# EAGLE design morse_lora_v1 (EAGLE 9.6.2)
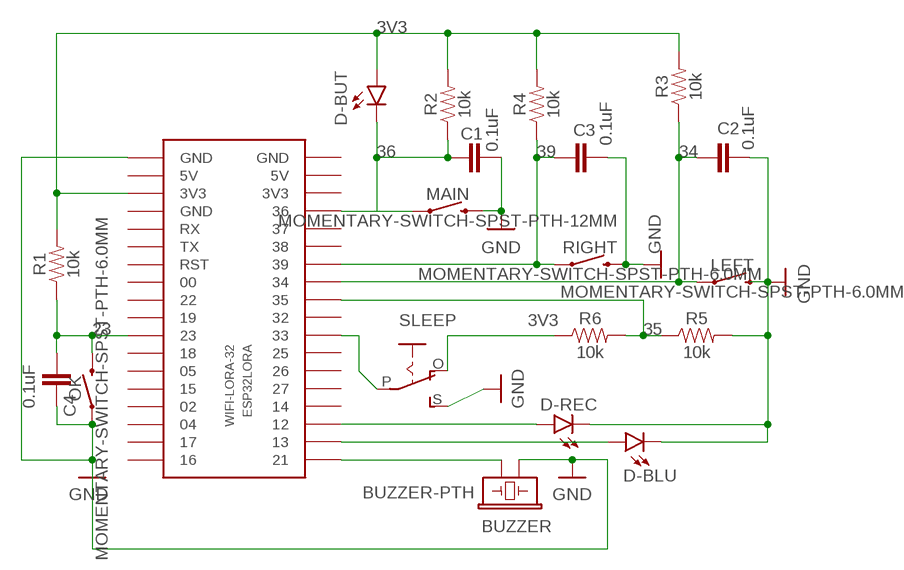
[diagram p0: schematic, sheet 1]

## Parts
BUZZER  BUZZER-PTH  [BUZZER-12MM]
C1  0.1uF  0.1UF-KIT-EZ-50V-20%  [CAP-PTH-SMALL-KIT]
C2  0.1uF  0.1UF-KIT-EZ-50V-20%  [CAP-PTH-SMALL-KIT]
C3  0.1uF  0.1UF-KIT-EZ-50V-20%  [CAP-PTH-SMALL-KIT]
C4  0.1uF  0.1UF-KIT-EZ-50V-20%  [CAP-PTH-SMALL-KIT]
D-BLU  LED5MM  [LED_5MM]
D-BUT  LED5MM  [LED_5MM]
D-REC  LED5MM  [LED_5MM]
ESP32LORA  WIFI-LORA-32  [2.54MM_2X18]
LEFT  MOMENTARY-SWITCH-SPST-PTH-6.0MM  [TACTILE_SWITCH_PTH_6.0MM]
MAIN  MOMENTARY-SWITCH-SPST-PTH-12MM  [TACTILE_SWITCH_PTH_12MM]
OK  MOMENTARY-SWITCH-SPST-PTH-6.0MM  [TACTILE_SWITCH_PTH_6.0MM]
R1  10k  10KOHM-HORIZ_KIT-1/4W-1%  [AXIAL-0.3-KIT]
R2  10k  10KOHM-HORIZ_KIT-1/4W-1%  [AXIAL-0.3-KIT]
R3  10k  10KOHM-HORIZ_KIT-1/4W-1%  [AXIAL-0.3-KIT]
R4  10k  10KOHM-HORIZ_KIT-1/4W-1%  [AXIAL-0.3-KIT]
R5  10k  10KOHM-HORIZ_KIT-1/4W-1%  [AXIAL-0.3-KIT]
R6  10k  10KOHM-HORIZ_KIT-1/4W-1%  [AXIAL-0.3-KIT]
RIGHT  MOMENTARY-SWITCH-SPST-PTH-6.0MM  [TACTILE_SWITCH_PTH_6.0MM]
SLEEP  EG1218S  [EG1218]

## Nets
3V3: D-BUT.A ESP32LORA.P$3(3V3) R1.P$2 R2.P$2 R3.P$2 R4.P$2 R6.P$1 SLEEP.O
23: C4.2 ESP32LORA.P$11 OK.3 R1.P$1
34: C2.2 ESP32LORA.P$29 LEFT.1 R3.P$1
35: ESP32LORA.P$28 R5.P$1 R6.P$2
36: C1.2 D-BUT.K(C) ESP32LORA.P$33 MAIN.1 R2.P$1
39: C3.1 ESP32LORA.P$30 R4.P$1 RIGHT.1
GND: BUZZER.- C1.1 C2.1 C3.2 C4.1 D-BLU.K(C) D-REC.K(C) ESP32LORA.P$1(GND) LEFT.3 MAIN.3 OK.1 R5.P$2 RIGHT.3 SLEEP.S
N$4: BUZZER.+ ESP32LORA.P$19
N$5: D-REC.A ESP32LORA.P$21
N$6: D-BLU.A ESP32LORA.P$20
N$13: ESP32LORA.P$26 SLEEP.P
Unconnected: ESP32LORA.P$2(5V) ESP32LORA.P$4(GND) ESP32LORA.P$5(RX) ESP32LORA.P$6(TX) ESP32LORA.P$7(RST) ESP32LORA.P$8 ESP32LORA.P$9 ESP32LORA.P$10 ESP32LORA.P$12 ESP32LORA.P$13 ESP32LORA.P$14 ESP32LORA.P$15 ESP32LORA.P$16 ESP32LORA.P$17 ESP32LORA.P$18 ESP32LORA.P$22 ESP32LORA.P$23 ESP32LORA.P$24 ESP32LORA.P$25 ESP32LORA.P$27 ESP32LORA.P$31 ESP32LORA.P$32 ESP32LORA.P$34(3V3) ESP32LORA.P$35(5V) ESP32LORA.P$36(GND)

## Library data of the parts
BUZZER = SparkFun-Electromechanical:BUZZER: Buzzer Small round buzzers that operate around the audible 2kHz range. You can use these as speakers to create simple music or user interfaces. Variant Overview: PTH - Mini Speaker - PC Mount 12mm 2.048kHz <https://www.sparkfun.com/products/7950> PTH_KIT - Mini Speaker - PC Mount 12mm 2.048kHz <https://www.sparkfun.com/products/7950> KIT simplifies soldering by adding stop mask to one side of the pads. PTH_NO_SILK - Mini Speaker - PC Mount 12mm 2.048kHz <https://www.sparkfun.com/products/7950> No silkscreen indicator of buzzer outline. PTH_KIT_NO_SILK - Mini Speaker - PC Mount 12mm 2.048kHz <https://www.sparkfun.com/products/7950> KIT package w/o silkscreen SMD - Buzzer Audio Magnetic (CCV-084B16) SMD buzzer used on, e.g. the LilyPad Buzzer <https://www.sparkfun.com/products/8463> and RFID USB Reader <https://www.sparkfun.com/products/9963>. SMD_KIT - Buzzer Audio Magnetic (CCV-084B16) SMD Buzzer with elongated pins to make soldering easier. Used on the SparkFun Simon Says - Surface Mount Soldering Kit <https://www.sparkfun.com/products/10935>.; PROD_ID: COMP-08253; SF_SKU: COM-07950
C1-C4 = SparkFun-Capacitors:0.1UF: 0.1µF ceramic capacitors A capacitor is a passive two-terminal electrical component used to store electrical energy temporarily in an electric field.; PROD_ID: CAP-08370
D-BLU D-BUT D-REC = SparkFun-LED:LED: LED (Generic) Standard schematic elements and footprints for 5mm, 3mm, 1206, and 0603 sized LEDs. Generic LEDs with no color specified.
ESP32LORA = ESP32_modules:WIFI-LORA-32
LEFT OK RIGHT = SparkFun-Switches:MOMENTARY-SWITCH-SPST: Momentary Switch (Pushbutton) - SPST Normally-open (NO) SPST momentary switches (buttons, pushbuttons). Variants PTH-12MM - 12mm square, through-hole Momentary Pushbutton Switch - 12mm Square <https://www.sparkfun.com/products/9190> (COM-09190) PTH-6.0MM, PTH-6.0MM-KIT - 6.0mm square, through-hole Mini Pushbutton Switch <https://www.sparkfun.com/products/97> (COM-00097) KIT package intended for soldering kit's - only one side of pads' copper is exposed. PTH-RIGHT-ANGLE-KIT - Right-angle, through-hole Right Angle Tactile Button <https://www.sparkfun.com/products/10791> - Used on SparkFun BigTime Watch Kit <https://www.sparkfun.com/products/11734> SMD-12MM - 12mm square, surface-mount Tactile Button - SMD (12mm) <https://www.sparkfun.com/products/12993> (COM-12993) Used on SparkFun PicoBoard <https://www.sparkfun.com/products/11888> SMD-4.5MM - 4.5mm Square Trackball Switch Used on SparkFun Blackberry Trackballer Breakout <https://www.sparkfun.com/products/13169> SMD-4.6MMX2.8MM - 4.60mm x 2.80mm, surface mount Used on SparkFun SAMD21 Mini Breakout <https://www.sparkfun.com/products/13664> SMD-5.2MM, SMD-5.2-REDUNDANT - 5.2mm square, surface-mount Mini Pushbutton Switch - SMD <https://www.sparkfun.com/products/8720> (COM-08720) Used on Arduino Pro Mini <https://www.sparkfun.com/products/11114> REDUNDANT package connects both switch circuits together SMD-6.0X3.5MM - 6.0 x 3.5mm, surface mount Momentary Reset Switch SMD <https://www.sparkfun.com/products/8229> (COM-08229) SMD-6.2MM-TALL - 6.2mm square, surface mount Tactile Button - SMD (6mm) <https://www.sparkfun.com/products/12992> Used on SparkFun Digital Sandbox <https://www.sparkfun.com/products/12651> SMD-RIGHT-ANGLE - Right-angle, surface mount Used on SparkFun Block for Intel® Edison - Arduino <https://www.sparkfun.com/products/13036>; PROD_ID: SWCH-08441; SF_SKU: COM-00097
MAIN = SparkFun-Switches:MOMENTARY-SWITCH-SPST: Momentary Switch (Pushbutton) - SPST Normally-open (NO) SPST momentary switches (buttons, pushbuttons). Variants PTH-12MM - 12mm square, through-hole Momentary Pushbutton Switch - 12mm Square <https://www.sparkfun.com/products/9190> (COM-09190) PTH-6.0MM, PTH-6.0MM-KIT - 6.0mm square, through-hole Mini Pushbutton Switch <https://www.sparkfun.com/products/97> (COM-00097) KIT package intended for soldering kit's - only one side of pads' copper is exposed. PTH-RIGHT-ANGLE-KIT - Right-angle, through-hole Right Angle Tactile Button <https://www.sparkfun.com/products/10791> - Used on SparkFun BigTime Watch Kit <https://www.sparkfun.com/products/11734> SMD-12MM - 12mm square, surface-mount Tactile Button - SMD (12mm) <https://www.sparkfun.com/products/12993> (COM-12993) Used on SparkFun PicoBoard <https://www.sparkfun.com/products/11888> SMD-4.5MM - 4.5mm Square Trackball Switch Used on SparkFun Blackberry Trackballer Breakout <https://www.sparkfun.com/products/13169> SMD-4.6MMX2.8MM - 4.60mm x 2.80mm, surface mount Used on SparkFun SAMD21 Mini Breakout <https://www.sparkfun.com/products/13664> SMD-5.2MM, SMD-5.2-REDUNDANT - 5.2mm square, surface-mount Mini Pushbutton Switch - SMD <https://www.sparkfun.com/products/8720> (COM-08720) Used on Arduino Pro Mini <https://www.sparkfun.com/products/11114> REDUNDANT package connects both switch circuits together SMD-6.0X3.5MM - 6.0 x 3.5mm, surface mount Momentary Reset Switch SMD <https://www.sparkfun.com/products/8229> (COM-08229) SMD-6.2MM-TALL - 6.2mm square, surface mount Tactile Button - SMD (6mm) <https://www.sparkfun.com/products/12992> Used on SparkFun Digital Sandbox <https://www.sparkfun.com/products/12651> SMD-RIGHT-ANGLE - Right-angle, surface mount Used on SparkFun Block for Intel® Edison - Arduino <https://www.sparkfun.com/products/13036>; PROD_ID: SWCH-09185; SF_SKU: COM-09190
R1-R6 = SparkFun-Resistors:10KOHM: 10kΩ resistor A resistor is a passive two-terminal electrical component that implements electrical resistance as a circuit element. Resistors act to reduce current flow, and, at the same time, act to lower voltage levels within circuits. - Wikipedia; PROD_ID: RES-12183
SLEEP = adafruit:EG1218: SLIDING SWITCH 0.1" spacing through hole, vertical SPDT slide switch http://www.ladyada.net/library/pcb/eaglelibrary.html

## Board
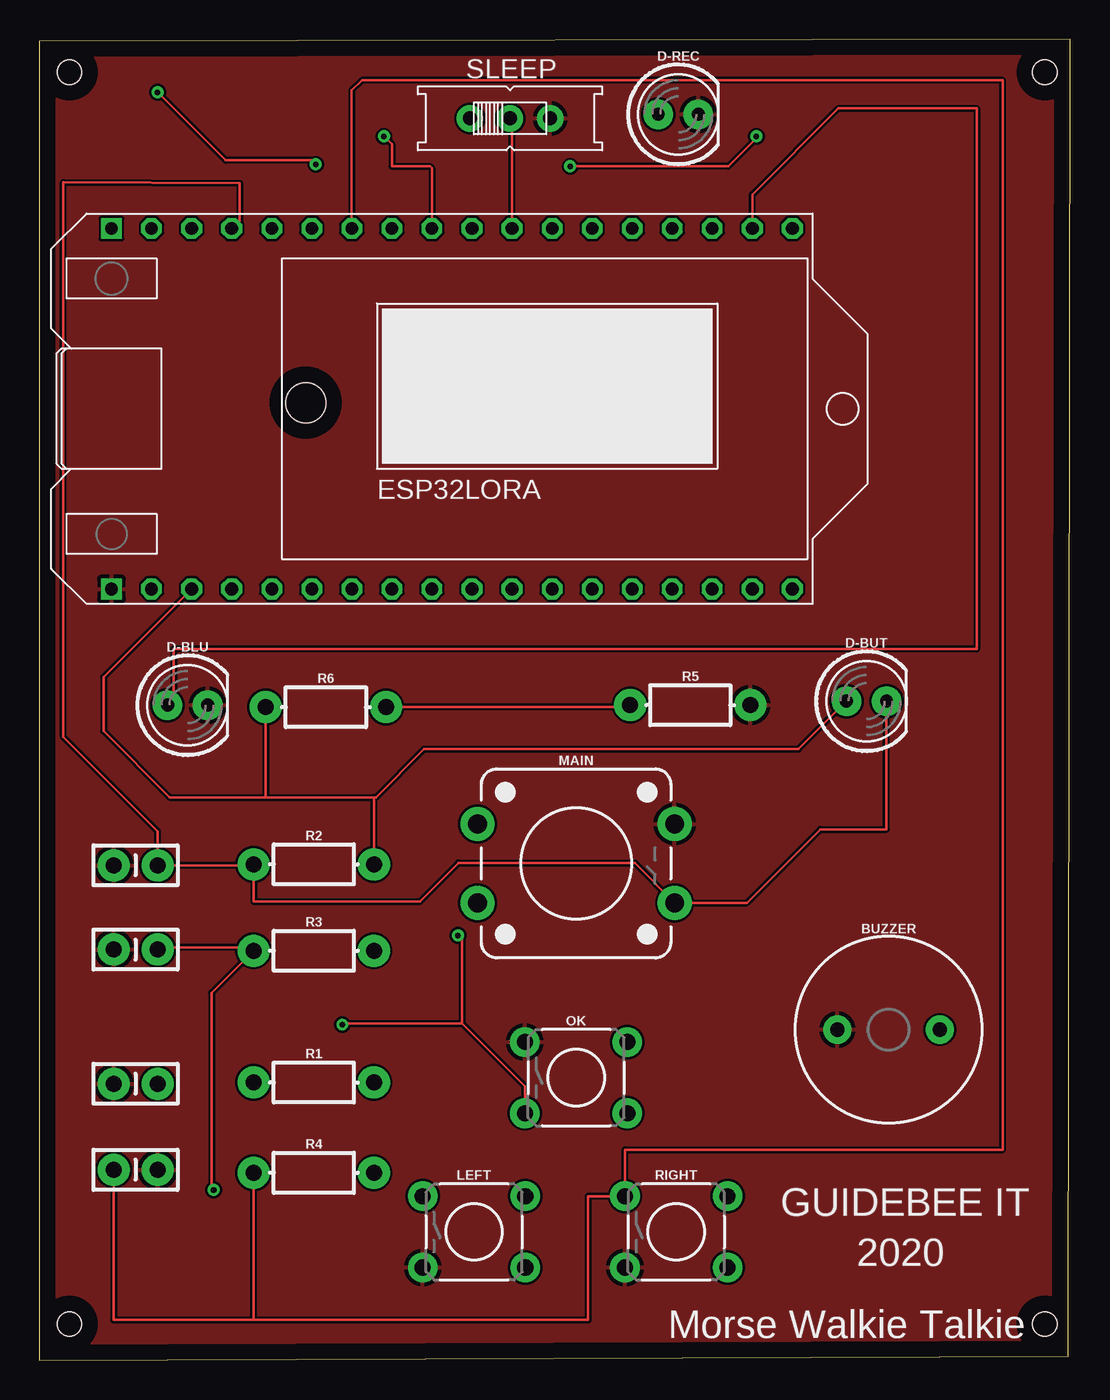
[diagram p1: board, top side]
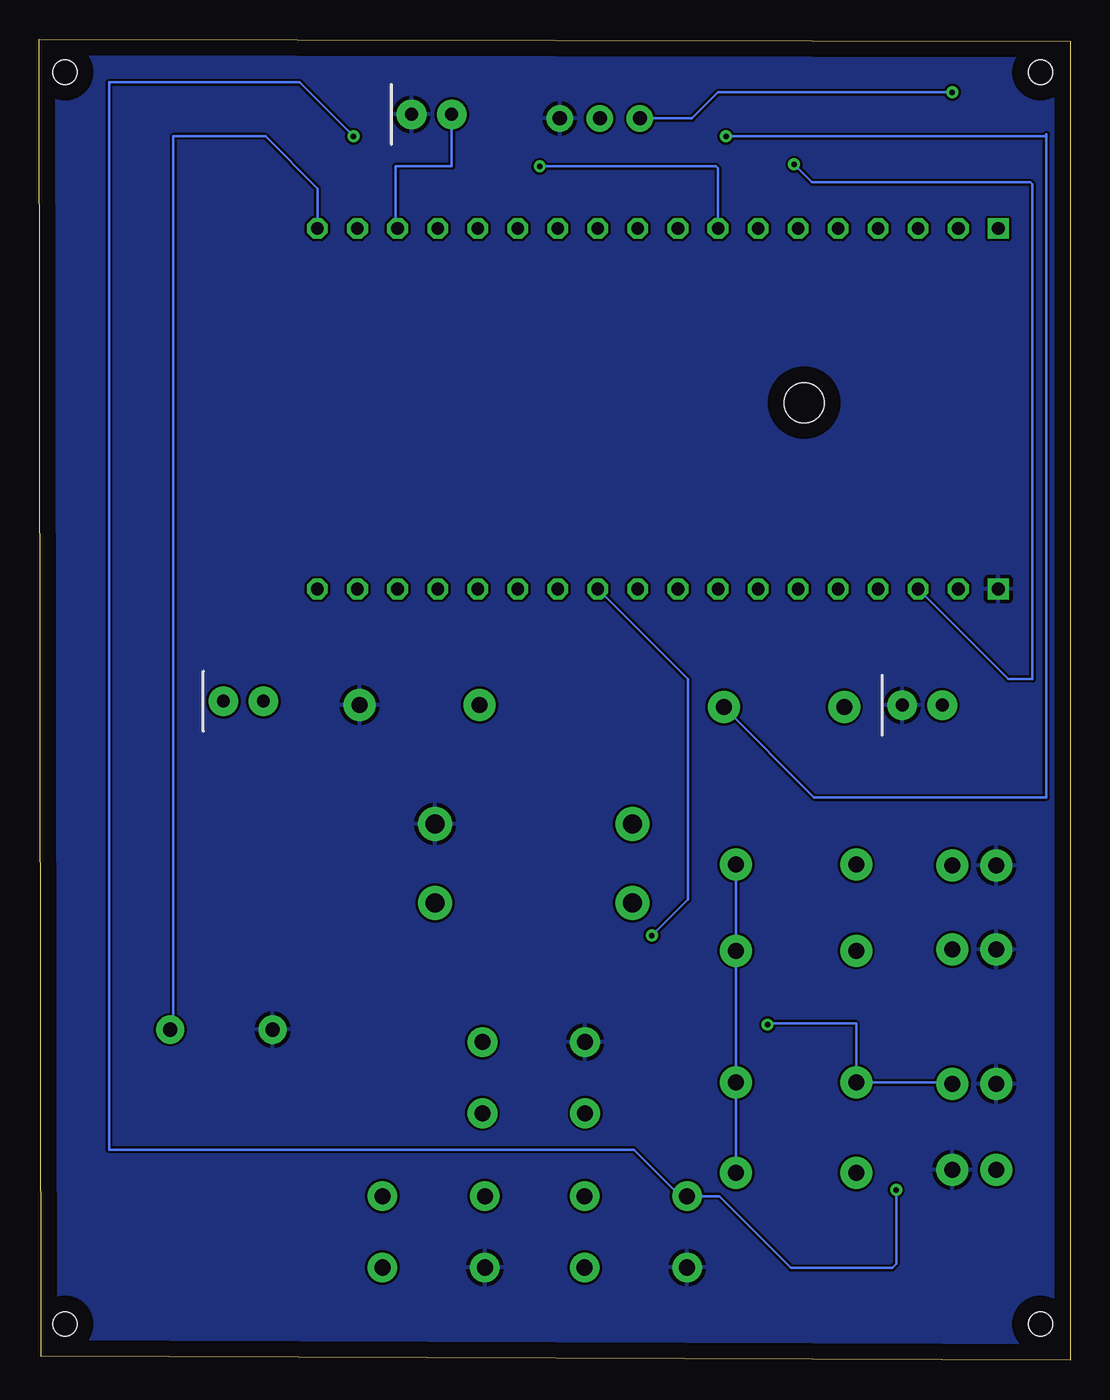
[diagram p2: board, bottom side, seen from below]

Size 65.38 x 83.74 mm. Coordinates in mm from the lower left corner, seen from the top.
Outline: 0,0 65.26,0.25 65.38,83.74 0,83.62 0,0
Copper layers (1*16): Top 0.035mm / dielectric 1.5mm / Bottom 0.035mm
Design rules "default": minimum track width 6mil, minimum drill 0.35mm, track to track 6mil, track to pad 6mil, pad to pad 6mil, via to via 6mil, smd to smd 6mil, copper to edge 40mil, drill to drill 6mil, minimum pad ring 10mil, minimum via ring 8mil, stop-mask expansion 4mil, vias tented up to drill 0mil, thermal gap 10mil
Holes 1.52 mm at 1.91,81.66 63.75,81.66 63.75,2.29 1.91,2.29
Holes 2.54 mm at 16.89,60.71

### Footprints (pad centres in the part's own frame; a part is rotated, then mirrored left to right if it is on the bottom)
BUZZER-12MM = drill 0.9 pad 1.778: + 3.25,0; - -3.25,0
CAP-PTH-SMALL-KIT = drill 1.016 pad 2.032: 1 -1.397,0; 2 1.397,0
LED_5MM = drill 0.813 pad 1.88: A -1.27,0; K 1.27,0
2.54MM_2X18 = drill 0.8 square: P$1 -20.32,-11.43; P$36 -20.32,11.43 | drill 0.8 octagon: P$2 -17.78,-11.43; P$3 -15.24,-11.43; P$4 -12.7,-11.43; P$5 -10.16,-11.43; P$6 -7.62,-11.43; P$7 -5.08,-11.43; P$8 -2.54,-11.43; P$9 0,-11.43; P$10 2.54,-11.43; P$11 5.08,-11.43; P$12 7.62,-11.43; P$13 10.16,-11.43; P$14 12.7,-11.43; P$15 15.24,-11.43; P$16 17.78,-11.43; P$17 20.32,-11.43; P$18 22.86,-11.43; P$19 22.86,11.43; P$20 20.32,11.43; P$21 17.78,11.43; P$22 15.24,11.43; P$23 12.7,11.43; P$24 10.16,11.43; P$25 7.62,11.43; P$26 5.08,11.43; P$27 2.54,11.43; P$28 0,11.43; P$29 -2.54,11.43; P$30 -5.08,11.43; P$31 -7.62,11.43; P$32 -10.16,11.43; P$33 -12.7,11.43; P$34 -15.24,11.43; P$35 -17.78,11.43
TACTILE_SWITCH_PTH_6.0MM = drill 1.016 pad 1.88: 1 -3.251,2.261; 2 3.251,2.261; 3 -3.251,-2.261; 4 3.251,-2.261
TACTILE_SWITCH_PTH_12MM = drill 1.2 pad 2.159: 1 6.25,-2.5; 2 -6.25,-2.5; 3 6.25,2.5; 4 -6.25,2.5
AXIAL-0.3-KIT = drill 1.016 pad 2.032: P$1 -3.81,0; P$2 3.81,0
EG1218 = drill 0.9 pad 1.676: O -2.54,0; P 0,0; S 2.54,0

### Placement (x,y rotation side)
BUZZER  53.85,20.96 0 top
C1  6.1,31.37 0 top
C2  6.1,26.04 0 top
C3  6.1,12.07 0 top
C4  6.1,17.53 0 top
D-BLU  9.4,41.53 0 top
D-BUT  52.45,41.78 0 top
D-REC  40.51,78.99 0 top
ESP32LORA  24.89,60.33 0 top
LEFT  27.56,8.13 0 top
MAIN  34.04,31.5 0 top
OK  34.04,17.91 0 top
R1  17.4,17.6 0 top
R2  17.4,31.43 0 top
R3  17.4,25.96 0 top
R4  17.4,11.87 0 top
R5  41.27,41.53 0 top
R6  18.16,41.4 0 top
RIGHT  40.39,8.13 0 top
SLEEP  29.84,78.74 0 top

### Tracks (layer width: path | path; a pad name or v marks a point on that pad's centre or on a via)
3V3  (via drill 0.35)
  Top 0.152: ESP32LORA.P$3 4.06,43.31 4.06,39.88 8.26,35.69 14.35,35.69 | R2.P$2 21.21,35.69 | D-BUT.A 48.13,38.73 24.38,38.73 21.34,35.69 21.21,35.69 | 14.35,35.69 21.21,35.69 | R6.P$1 14.35,35.69 | v7.49,80.39 11.81,76.07 17.27,76.07 v17.53,75.82
  Bottom 0.152: R2.P$2 R3.P$2 R1.P$2 R4.P$2 | SLEEP.O 24,78.74 22.35,80.39 v7.49,80.39 | v17.53,75.82 16.38,74.68 2.54,74.68 2.41,74.55 2.41,43.18 3.94,43.18 ESP32LORA.P$3
23  (via drill 0.35)
  Top 0.152: OK.3 30.79,17.35 26.8,21.34 | v26.54,26.92 26.8,26.67 26.8,21.34 | v19.21,21.27 19.27,21.34 26.8,21.34
  Bottom 0.152: v19.21,21.27 19.21,21.34 13.59,21.34 R1.P$1 7.57,17.6 C4.2 | ESP32LORA.P$11 24.26,43.18 24.26,29.21 v26.54,26.92
34  (via drill 0.35)
  Top 0.152: v45.47,77.6 45.47,77.47 43.69,75.69 v33.66,75.69 | C2.2 7.62,26.16 13.59,26.16 R3.P$1 10.92,23.29 10.92,10.92 v11.05,10.8
  Bottom 0.152: v45.47,77.6 48.9,81.03 60.96,81.03 60.96,13.34 27.69,13.34 24.74,10.39 LEFT.1 22.28,10.39 17.73,5.84 11.3,5.84 11.05,6.1 v11.05,10.8 | v33.66,75.69 22.48,75.69 22.35,75.56 ESP32LORA.P$29
35  (via drill 0.35)
  Top 0.152: R6.P$2 37.34,41.4 R5.P$1 | v21.84,77.6 22.35,77.09 22.35,75.69 24.77,75.69 24.89,75.56 ESP32LORA.P$28
  Bottom 0.152: R6.P$2 16.26,35.69 1.52,35.69 1.52,77.72 1.65,77.6 v21.84,77.6
36
  Top 0.152: ESP32LORA.P$33 12.7,72.26 12.7,74.61 1.52,74.68 1.52,39.5 7.5,33.53 C1.2 13.52,31.37 R2.P$1 13.59,29.08 24.13,29.08 26.58,31.53 37.75,31.53 MAIN.1 44.86,29 49.52,33.66 53.72,33.66 D-BUT.K
39
  Top 0.152: ESP32LORA.P$30 19.81,80.52 20.45,81.15 61.09,81.15 61.09,13.34 37.13,13.34 RIGHT.1 34.8,10.39 34.8,2.54 13.59,2.54 | C3.1 4.7,2.54 13.59,2.54 | 13.59,2.54 R4.P$1
GND
  pour Top: 0.13,83.69 0.13,1.91 1.65,0.38 65.28,0.38 65.28,83.69
  pour Bottom: 0.38,83.31 0.38,0.51 63.63,0.51 65.18,2.06 65.18,83.31
N$4
  Bottom 0.152: BUZZER.+ 56.9,20.96 56.9,77.6 51.05,77.6 47.75,74.3 ESP32LORA.P$19
N$5
  Bottom 0.152: D-REC.A 39.24,75.69 42.8,75.69 42.8,71.88 ESP32LORA.P$21
N$6
  Top 0.152: ESP32LORA.P$20 45.21,73.91 50.67,79.38 59.44,79.38 59.44,45.08 8.51,45.08 8.51,41.91 D-BLU.A
N$13
  Top 0.152: ESP32LORA.P$26 29.97,78.61 SLEEP.P

### Text on the board
tNames: GUIDEBEE IT | 2020 | Morse Walkie Talkie